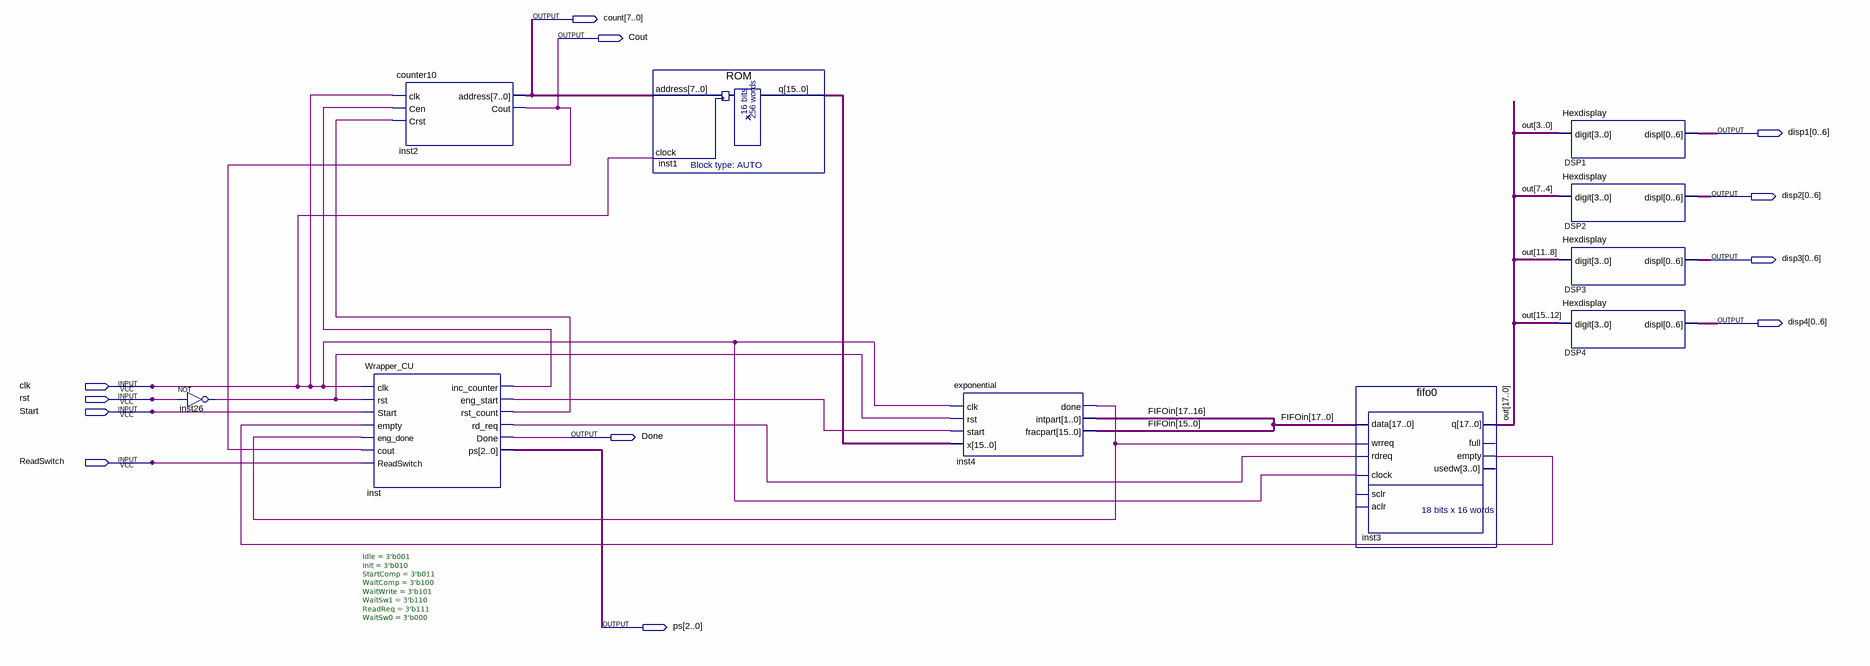
[diagram p0: schematic sheet]
// Quartus schematic ExpWrapped.bdf as structural Verilog: 10 symbols, 12 pins
module ExpWrapped (
  input  clk,
  input  rst,
  input  Start,
  input  ReadSwitch,
  output [7:0] count,
  output Cout,
  output [0:6] disp1,
  output [0:6] disp2,
  output [0:6] disp3,
  output [0:6] disp4,
  output Done,
  output [2:0] ps
);

  wire inst3_empty, inst4_done, inst26_out, inst_eng_start, inst_inc_counter, inst_rd_req, inst_rst_count;
  wire [15:0] inst1_q;
  wire [17:0] FIFOin, out;

  not inst26 (inst26_out, rst);
  counter10 inst2 (.clk(clk), .Cen(inst_inc_counter), .Crst(inst_rst_count), .address(count), .Cout(Cout));
  Wrapper_CU #(.Idle(3'b001), .Init(3'b010), .StartComp(3'b011), .WaitComp(3'b100), .WaitWrite(3'b101), .WaitSw1(3'b110), .ReadReq(3'b111), .WaitSw0(3'b000)) inst (
    .clk(clk), .rst(inst26_out), .Start(Start), .empty(inst3_empty), .eng_done(inst4_done), .cout(Cout),
    .ReadSwitch(ReadSwitch), .inc_counter(inst_inc_counter), .eng_start(inst_eng_start),
    .rst_count(inst_rst_count), .rd_req(inst_rd_req), .Done(Done), .ps(ps));
  ROM inst1 (.address(count), .clock(clk), .q(inst1_q));
  exponential inst4 (
    .clk(clk), .rst(inst26_out), .start(inst_eng_start), .x(inst1_q), .done(inst4_done),
    .intpart(FIFOin[17:16]), .fracpart(FIFOin[15:0]));
  fifo0 inst3 (
    .data(FIFOin), .wrreq(inst4_done), .rdreq(inst_rd_req), .clock(clk), .q(out), .empty(inst3_empty));  // open: sclr, aclr, full, usedw
  Hexdisplay DSP1 (.digit(out[3:0]), .displ(disp1));
  Hexdisplay DSP2 (.digit(out[7:4]), .displ(disp2));
  Hexdisplay DSP3 (.digit(out[11:8]), .displ(disp3));
  Hexdisplay DSP4 (.digit(out[15:12]), .displ(disp4));
endmodule
